# Altium project LDR.PrjPcb
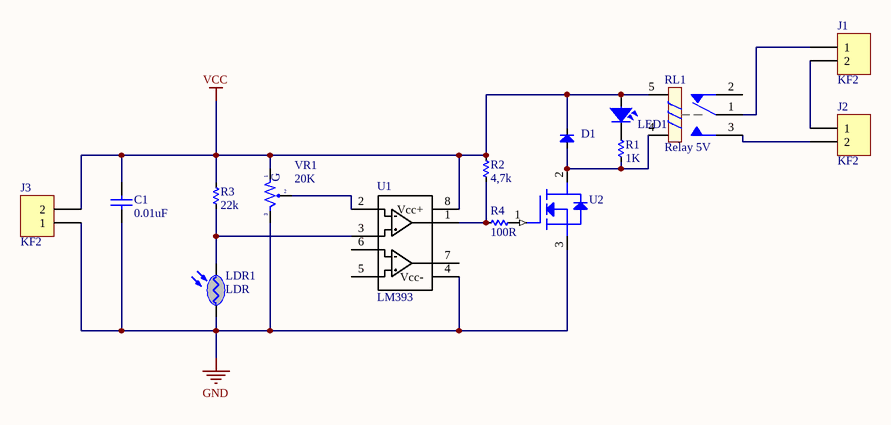
[diagram p0: Sheet1.SchDoc]
1 sheet, 15 parts. Net scope: global (net labels, ports and power ports of the same name join across sheets).
Board file: PCB2.PcbDoc

## Sheet Sheet1.SchDoc
size A

### Parts
C1  value 0.01uF  [Cap Non-Pol 3mm]  (hidden comment: Cap Non-pol)
D1  Diode  [DIO-1A-SMALL]  (value not drawn)
J1  KF2  [KF2-3.5]
J2  KF2  [KF2-3.5]
J3  KF2  [KF2-3.5]
LDR1  LDR  [CDS]
LED1  LED  [LED-3MM-RED]  (value not drawn)
R1  1K  [RES-1/4W]
R2  4,7k  [RES-1/4W]
R3  22k  [RES-1/4W]
R4  100R  [RES-1/4W]
RL1  Relay 5V  [RELAY 5]
U1  LM393  [DIP8]
U2  IRF540_1  [TO-220N]  (value not drawn)
VR1  20K  [VR-S2]

### Nets
GND: C1.1 J3.1 LDR1.1(A) U1.4(Vcc-) U2.3(S) VR1.3
VCC: C1.2 D1.2(K) J3.2 LED1.1 R2.1 R3.1 RL1.5 U1.8(Vcc+) VR1.1
NetD1_1: D1.1(A) R1.1 RL1.4 U2.2(D)
NetJ1_1: J1.1 RL1.1
NetJ1_2: J1.2 J2.1
NetJ2_2: J2.2 RL1.3
NetLDR1_2: LDR1.2(K) R3.2 U1.3
NetLED1_2: LED1.2 R1.2
NetR2_2: R2.2 R4.1 U1.1
NetR4_2: R4.2 U2.1(G)
NetU1_2: U1.2 VR1.2

Not connected (* = marked no-connect by the designer): RL1 2; U1 5 6 7

### Notes on the sheet
- (in symbol VR-S) G

### Library data of the parts
C1 = Cap Non-pol: Non-polarized Capacitor; Published: 8-Jun-2000; LatestRevisionDate: 17-Jul-2002; LatestRevisionNote: Re-released for DXP Platform.; PackageReference: RAD-0.3; Publisher: Altium Limited
D1 = Diode: Default Diode; Code - JEDEC: DO-214-AB; Value: 1N5007; Published: 8-Jun-2000; Revision: July-2002: Re-released for DXP Platform.; Publisher: Altium Limited
J1-J3 = KF2: Manufacturer: Würth Elektronik eiSos GmbH; partNo: 691103110002; ComponentLink1 Description: Manufacturer; ComponentLink2 Description: Datasheet; NoPins: 2; Created Date: 29 October 2013; ComponentLink1URL: http://www.we-online.com; ComponentLink2URL: http://katalog.we-online.de/em/datasheet/6911031100xx.pdf; Created by: Karrer Zheng
LDR1 = LDR: Quang Tro
LED1 = LED: LED Single colour Green and Red; Value: LED 3 ly Single Colour
R1-R4 = Res: Manufacturer: Generic Components; Class: Passive; SubClass: R; Published: 08/06/2000; Publisher: Altium Hobart Technology Centre
RL1 = Relay 5: Relay SPDT,10A - 12VDC 5 Pin; Value: Relay SPDT, 10A, 12V
U1 = LM393: IC DUAL COMPARATOR
U2 = IRF540_1: IRF9540 - N-CHANNEL POWER MOSFETS; Vendor: Digikey; Publisher: Hoang Nguyen; Price: 7.000 VND; ComponentLink2Description: Open Datasheet; ComponentLink2URL: H:\LIBRARY\LIBRARY.Datasheet\IRF540.pdf; Published: 13-April-2009; ComponentLink1Description: Digikey Part Link
VR1 = VR-S: Var Resistor; Value: Volume 50k